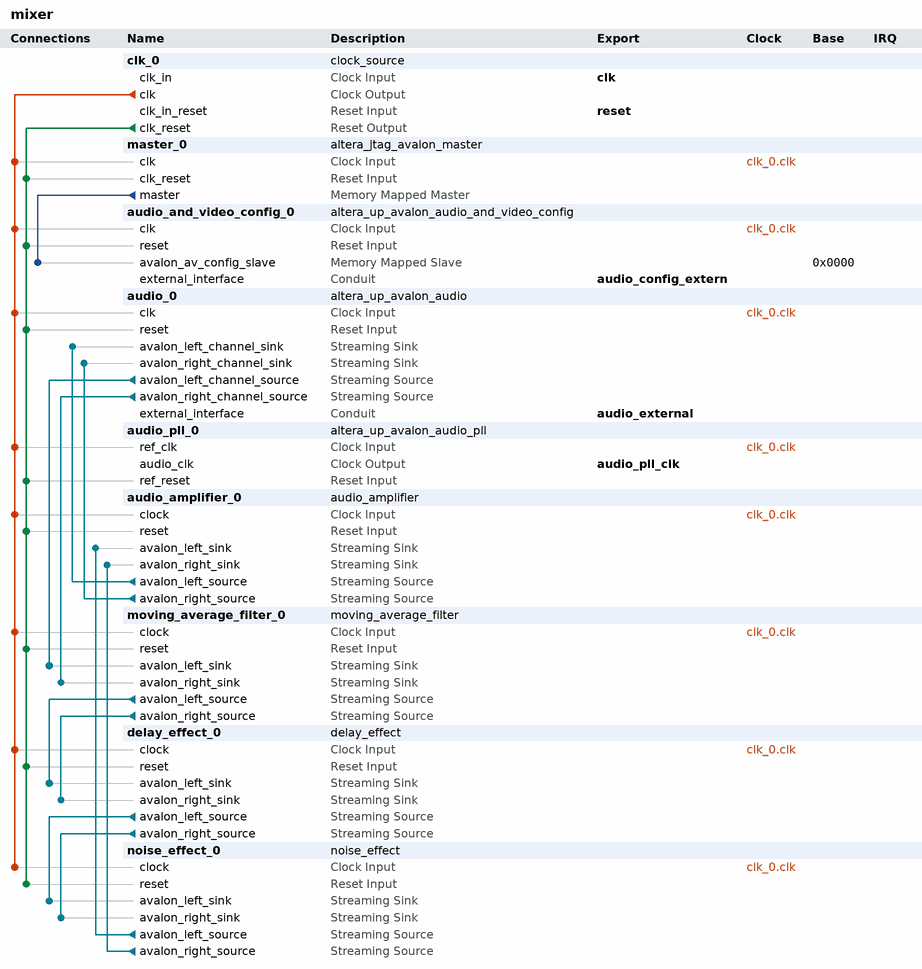
[diagram p0: system contents]
# Platform Designer (Qsys) system mixer, Cyclone V 5CSEMA5F31C6
# Parameters at their usual value, and those the tool derives, are not listed.
package require -exact qsys 18.0
create_system mixer
set_project_property DEVICE_FAMILY {Cyclone V}
set_project_property DEVICE 5CSEMA5F31C6

add_instance clk_0 clock_source 18.1
set_instance_parameter_value clk_0 clockFrequency 50000000

add_instance master_0 altera_jtag_avalon_master 18.1

add_instance audio_and_video_config_0 altera_up_avalon_audio_and_video_config 18.0
set_instance_parameter_value audio_and_video_config_0 audio_in {Line In to ADC}
set_instance_parameter_value audio_and_video_config_0 bit_length 24
set_instance_parameter_value audio_and_video_config_0 board DE1-SoC
set_instance_parameter_value audio_and_video_config_0 line_in_bypass false
set_instance_parameter_value audio_and_video_config_0 sampling_rate {48 kHz}

add_instance audio_0 altera_up_avalon_audio 18.0
set_instance_parameter_value audio_0 audio_in true
set_instance_parameter_value audio_0 avalon_bus_type Streaming
set_instance_parameter_value audio_0 dw 24

add_instance audio_pll_0 altera_up_avalon_audio_pll 18.0
set_instance_parameter_value audio_pll_0 audio_clk_freq 18.432
set_instance_parameter_value audio_pll_0 gui_refclk 50.0

add_instance audio_amplifier_0 audio_amplifier 1.1

add_instance moving_average_filter_0 moving_average_filter 1.1

add_instance delay_effect_0 delay_effect 1.1

add_instance noise_effect_0 noise_effect 1.1

# connections
add_connection clk_0.clk audio_0.clk clock
add_connection clk_0.clk audio_amplifier_0.clock clock
add_connection clk_0.clk audio_and_video_config_0.clk clock
add_connection clk_0.clk audio_pll_0.ref_clk clock
add_connection clk_0.clk delay_effect_0.clock clock
add_connection clk_0.clk master_0.clk clock
add_connection clk_0.clk moving_average_filter_0.clock clock
add_connection clk_0.clk noise_effect_0.clock clock
add_connection clk_0.clk_reset audio_0.reset reset
add_connection clk_0.clk_reset audio_amplifier_0.reset reset
add_connection clk_0.clk_reset audio_and_video_config_0.reset reset
add_connection clk_0.clk_reset audio_pll_0.ref_reset reset
add_connection clk_0.clk_reset delay_effect_0.reset reset
add_connection clk_0.clk_reset master_0.clk_reset reset
add_connection clk_0.clk_reset moving_average_filter_0.reset reset
add_connection clk_0.clk_reset noise_effect_0.reset reset
add_connection master_0.master audio_and_video_config_0.avalon_av_config_slave avalon
set_connection_parameter_value master_0.master/audio_and_video_config_0.avalon_av_config_slave baseAddress 0x0000
add_connection audio_0.avalon_left_channel_source moving_average_filter_0.avalon_left_sink avalon_streaming
add_connection audio_0.avalon_right_channel_source moving_average_filter_0.avalon_right_sink avalon_streaming
add_connection audio_amplifier_0.avalon_left_source audio_0.avalon_left_channel_sink avalon_streaming
add_connection audio_amplifier_0.avalon_right_source audio_0.avalon_right_channel_sink avalon_streaming
add_connection delay_effect_0.avalon_left_source noise_effect_0.avalon_left_sink avalon_streaming
add_connection delay_effect_0.avalon_right_source noise_effect_0.avalon_right_sink avalon_streaming
add_connection moving_average_filter_0.avalon_left_source delay_effect_0.avalon_left_sink avalon_streaming
add_connection moving_average_filter_0.avalon_right_source delay_effect_0.avalon_right_sink avalon_streaming
add_connection noise_effect_0.avalon_left_source audio_amplifier_0.avalon_left_sink avalon_streaming
add_connection noise_effect_0.avalon_right_source audio_amplifier_0.avalon_right_sink avalon_streaming

# exported interfaces
add_interface audio_config_extern conduit end
set_interface_property audio_config_extern EXPORT_OF audio_and_video_config_0.external_interface
add_interface audio_external conduit end
set_interface_property audio_external EXPORT_OF audio_0.external_interface
add_interface audio_pll_clk clock source
set_interface_property audio_pll_clk EXPORT_OF audio_pll_0.audio_clk
add_interface clk clock sink
set_interface_property clk EXPORT_OF clk_0.clk_in
add_interface reset reset sink
set_interface_property reset EXPORT_OF clk_0.clk_in_reset

set_interconnect_requirement {$system} qsys_mm.clockCrossingAdapter HANDSHAKE
set_interconnect_requirement {$system} qsys_mm.enableEccProtection FALSE
set_interconnect_requirement {$system} qsys_mm.insertDefaultSlave FALSE
set_interconnect_requirement {$system} qsys_mm.maxAdditionalLatency 1

save_system mixer.qsys
